# EasyEDA Pro project ProDoc_P1_2024-06-28.epro

# Schematic Schematic1
Drawed: Triority
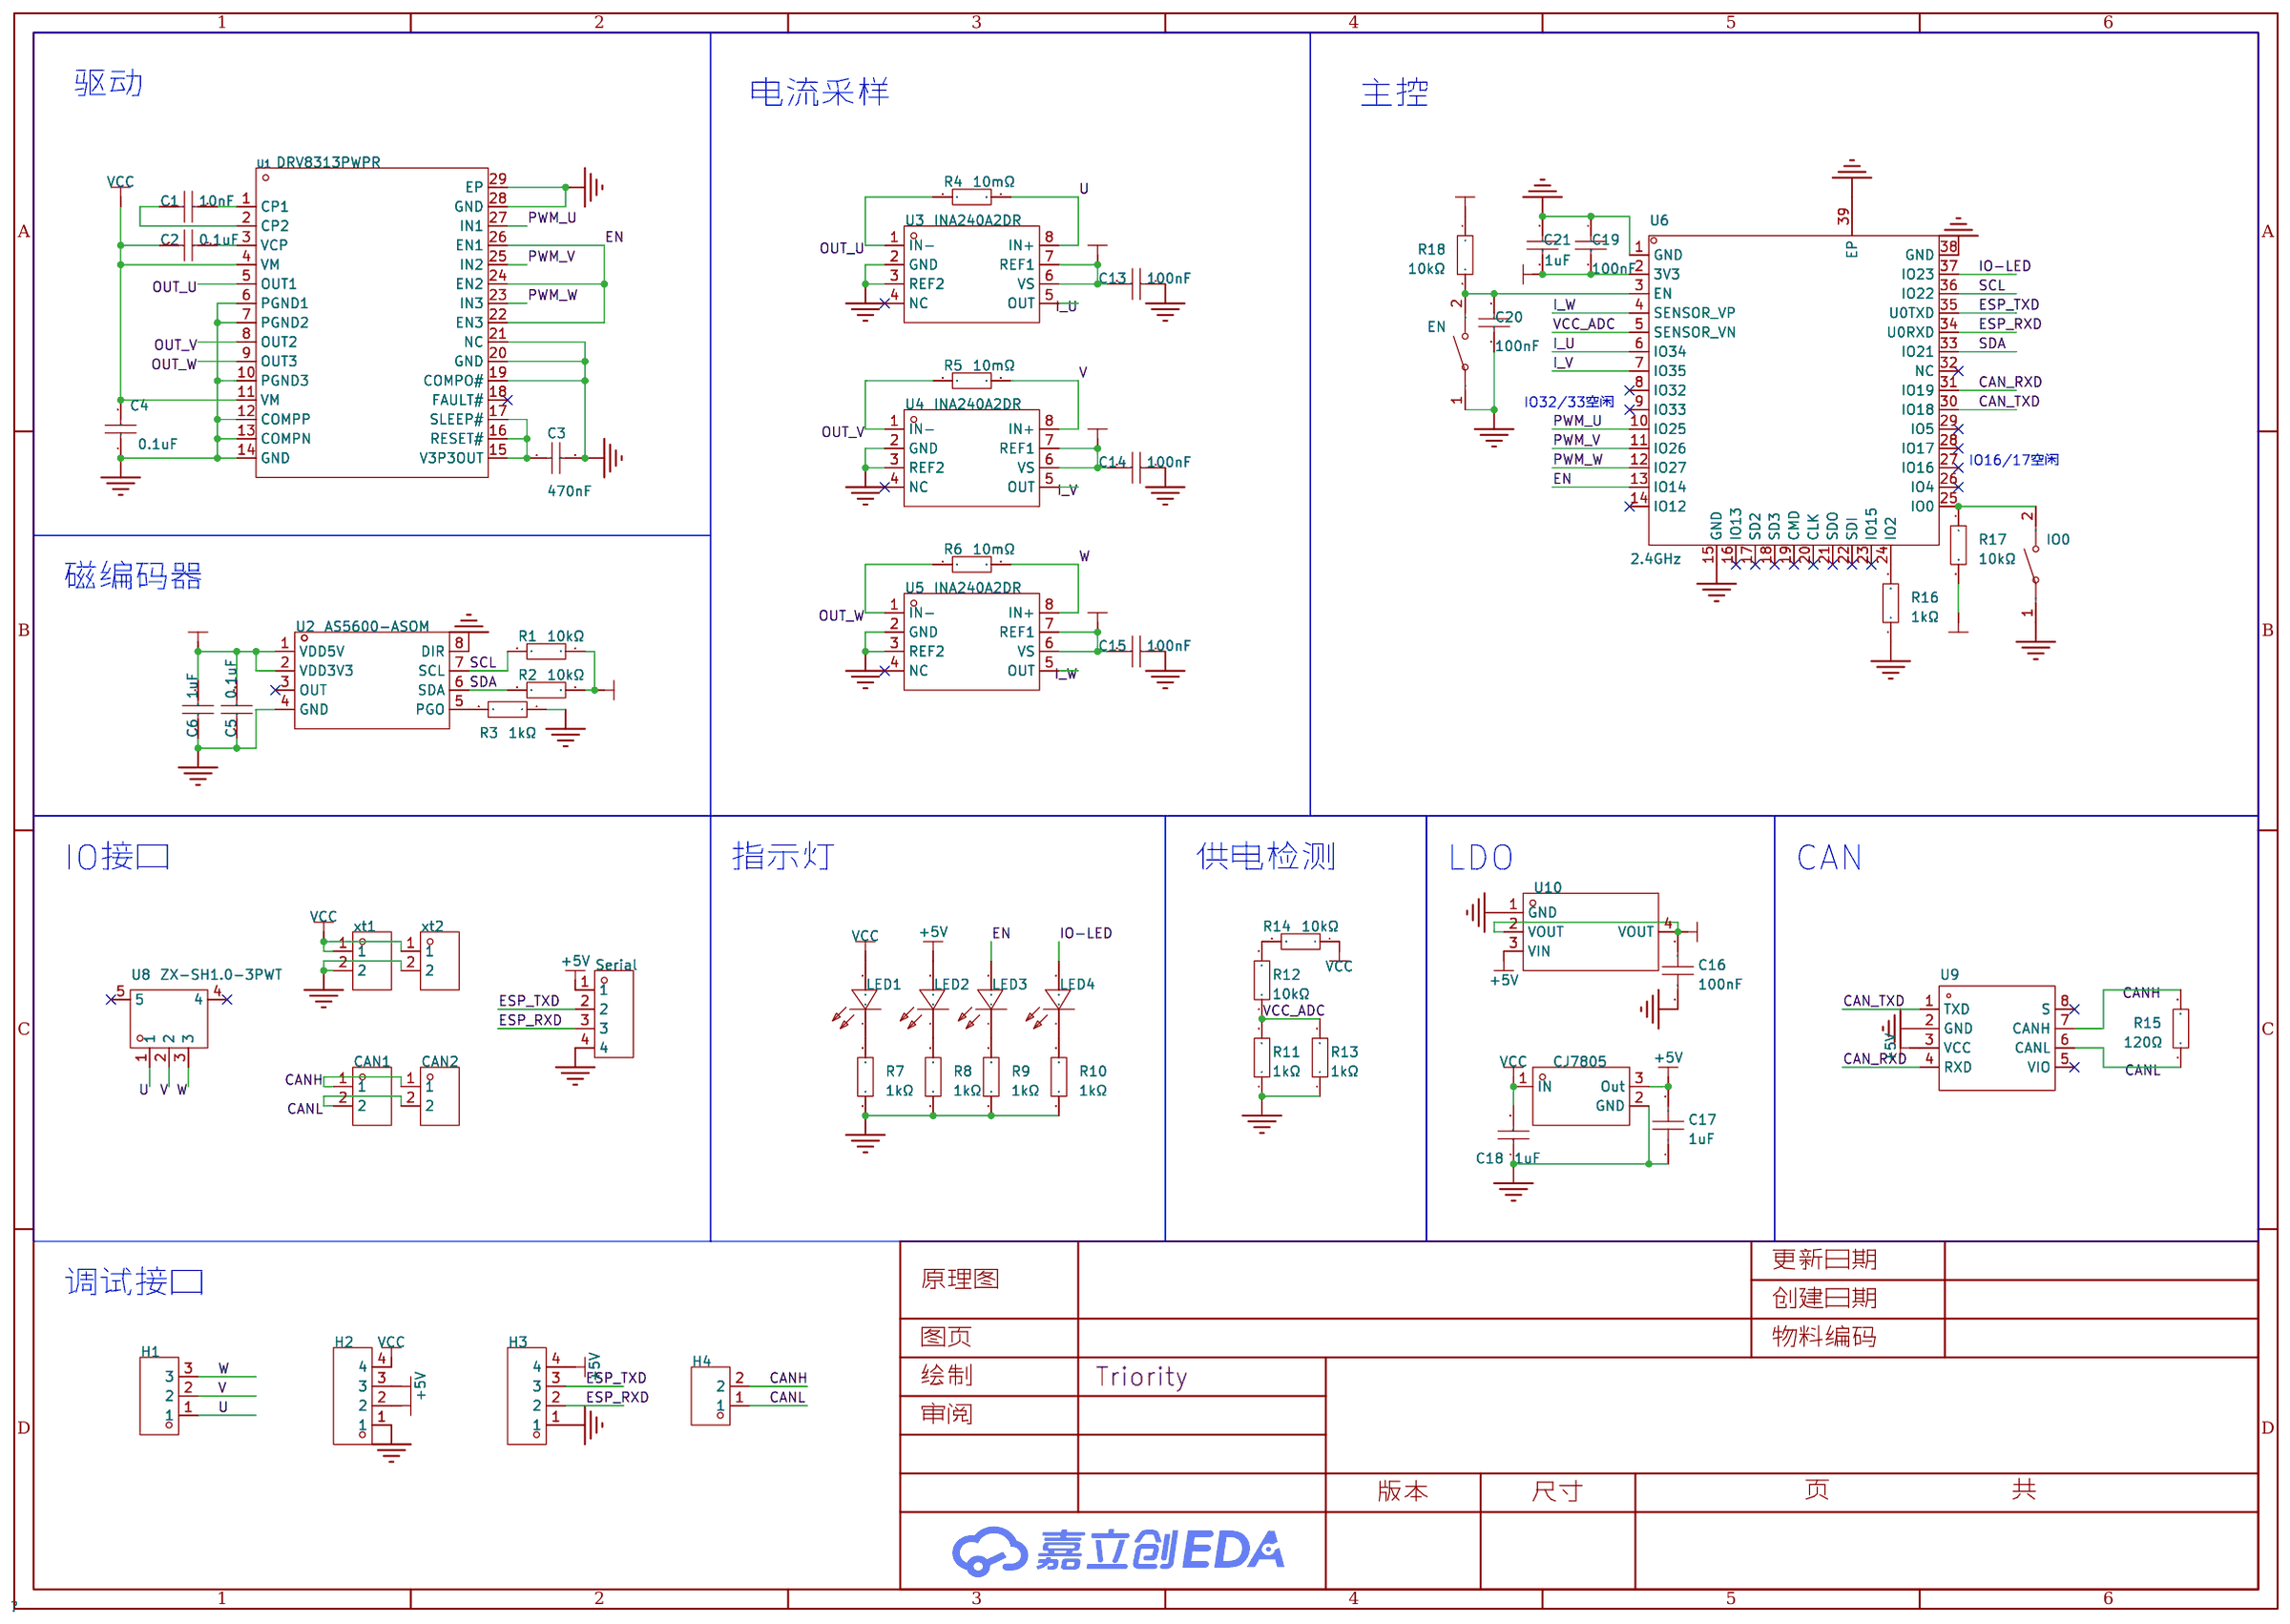
[diagram p0: schematic sheet]

## Parts
C1  10nF  [C0603]
C2  0.1uF  [C0603]
C3  470nF  [C0603]
C4  0.1uF  [C0603]
C5  0.1uF  [C0603]
C6  1uF  [C0603]
C13  100nF  [C0603]
C14  100nF  [C0603]
C15  100nF  [C0603]
C16  100nF  [C0603]
C17  1uF  [C0603]
C18  1uF  [C0603]
C19  100nF  [C0603]
C20  100nF  [C0603]
C21  1uF  [C0603]
CAN1  XH-2AW  [CONN-TH_XH-2AW_C2908611]
CAN2  XH-2AW  [CONN-TH_XH-2AW_C2908611]
CJ7805  CJ7805 3%  [TO-252-2_L6.6-W6.1-P4.58-LS10.1-BR-CW]
EN  K2-1107ST-A4DW-06  [KEY-SMD_L6.2-W3.6-LS8.0]
H1  PZ254V-11-03P  [HDR-TH_3P-P2.54-V-M]
H2  PZ254V-11-04P  [HDR-TH_4P-P2.54-V-M]
H3  PZ254V-11-04P  [HDR-TH_4P-P2.54-V-M]
H4  PZ254V-11-02P  [HDR-TH_2P-P2.54-V-M]
IO0  K2-1107ST-A4DW-06  [KEY-SMD_L6.2-W3.6-LS8.0]
LED1  KT-0603R  [LED0603-RD]
LED2  KT-0603R  [LED0603-RD]
LED3  KT-0603R  [LED0603-RD]
LED4  KT-0603R  [LED0603-RD]
R1  10kΩ  [R0603]
R2  10kΩ  [R0603]
R3  1kΩ  [R0603]
R4  10mΩ  [R1206]
R5  10mΩ  [R1206]
R6  10mΩ  [R1206]
R7  1kΩ  [R0603]
R8  1kΩ  [R0603]
R9  1kΩ  [R0603]
R10  1kΩ  [R0603]
R11  1kΩ  [R0603]
R12  10kΩ  [R0603]
R13  1kΩ  [R0603]
R14  10kΩ  [R0603]
R15  120Ω  [R0603]
R16  1kΩ  [R0603]
R17  10kΩ  [R0603]
R18  10kΩ  [R0603]
Serial  XH-4AW  [CONN-TH_XH-4AW]
U1  DRV8313PWPR  [HTSSOP-28_L9.8-W4.5-P0.65-LS6.6-BL-EP]
U2  AS5600-ASOM  [SOIC-8_L5.0-W4.0-P1.27-LS6.0-BL]
U3  INA240A2DR  [SOIC-8_L4.9-W3.9-P1.27-LS6.0-BL]
U4  INA240A2DR  [SOIC-8_L4.9-W3.9-P1.27-LS6.0-BL]
U5  INA240A2DR  [SOIC-8_L4.9-W3.9-P1.27-LS6.0-BL]
U6  2.4GHz  [WIRELM-SMD_ESP32-S]
U8  ZX-SH1.0-3PWT  [CONN-SMD_3P-P1.00_MEGASTAR_ZX-SH1.0-3PWT]
U9  TJA1051T/3/1J  [SOIC-8_L4.9-W3.9-P1.27-LS6.0-BL]
U10  AMS1117-3.3  [SOT-223-3_L6.5-W3.4-P2.30-LS7.0-BR]
xt1  XT30U-M  [CONN-TH_XT30U-M]
xt2  XT30U-M  [CONN-TH_XT30U-M]

## Library data of the parts
C1 = CC0603KRX7R9BB103: 容值:10nF;精度:±10%;额定电压:50V;材质(温度系数):X7R;; LCSC Part Name: 10nF ±10% 50V; Supplier Part: C100042; Manufacturer: YAGEO(国巨); Supplier Footprint: 0603; JLCPCB Part Class: 扩展库; Datasheet: https://atta.szlcsc.com/upload/public/pdf/source/20181008/C309510_22F155564471FAF6A489F7D68F34234E.pdf; Supplier: LCSC; Tolerance: ±10%; Voltage Rated: 50V; Temperature Coefficient: X7R
C2 C4 C5 C13-C15 C19 C20 = 0603B104K500NT: 容值:100nF;精度:±10%;额定电压:50V;材质(温度系数):X7R;; LCSC Part Name: 100nF ±10% 50V; Supplier Part: C30926; Manufacturer: FH(风华); Supplier Footprint: 0603; JLCPCB Part Class: Extended Part; Datasheet: https://atta.szlcsc.com/upload/public/pdf/source/20200305/C486355_26A10D38EF8C2A5C37091D0039909270.pdf; Supplier: LCSC; Tolerance: ±10%; Voltage Rated: 50V; Temperature Coefficient: X7R
C3 = CL10B474KA8NNNC: 容值:470nF;精度:±10%;额定电压:25V;材质(温度系数):X7R;; LCSC Part Name: 470nF ±10% 25V; Supplier Part: C1623; Manufacturer: SAMSUNG(三星); Supplier Footprint: 0603; JLCPCB Part Class: Basic Part; Datasheet: https://atta.szlcsc.com/upload/public/pdf/source/20160218/1457707763339.pdf; Supplier: LCSC; Tolerance: ±10%; Voltage Rated: 25V; Temperature Coefficient: X7R
C6 C18 C21 = CL10A105KB8NNNC: 容值:1uF;精度:±10%;额定电压:50V;材质(温度系数):X5R;; LCSC Part Name: 1uF ±10% 50V; Supplier Part: C15849; Manufacturer: SAMSUNG(三星); Supplier Footprint: 0603; JLCPCB Part Class: Basic Part; Datasheet: https://atta.szlcsc.com/upload/public/pdf/source/20160218/1457707763339.pdf; Supplier: LCSC; Tolerance: ±10%; Voltage Rated: 50V; Temperature Coefficient: X5R
C16 C17 = CC0603KRX7R9BB104: LCSC Part Name: 100nF ±10% 50V; Supplier Part: C14663; Manufacturer: YAGEO(国巨); Supplier Footprint: 0603; JLCPCB Part Class: 基础库; Datasheet: https://atta.szlcsc.com/upload/public/pdf/source/20180910/C282072_33301C7F631E79921B82A8DAC6BCC5B3.pdf; Supplier: LCSC; Tolerance: ±10%; Voltage Rated: 50V; Temperature Coefficient: X7R
CAN1 CAN2 = XH-2AW_C2908611: LCSC Part Name: 1x2P 间距:2.54mm 弯插 系列:XH; Supplier Part: C2908611; Manufacturer: HCTL(华灿天禄); Supplier Footprint: 弯插,P=2.54mm; JLCPCB Part Class: 扩展库; Datasheet: https://atta.szlcsc.com/upload/public/pdf/source/20230711/B565BAF3B11666EF6B81B3605408F2BD.pdf; Supplier: LCSC; Pins Structure: 1x2P; Pitch: 2.54mm; Mounting Style: 弯插; Reference Series: XH; Number of Pins: 2P; Number of Rows: 1; Number of PINs Per Row: 2; Current Rating (Max): 3A; Contact Material: 黄铜; Contact Plating: 锡; Operating Temperature Range: -25℃~+85℃
CJ7805 = CJ7805 3%: LCSC Part Name: 输入35V 输出5V 1.5A; Supplier Part: C21706; Manufacturer: CJ(江苏长电/长晶); Supplier Footprint: TO-252-2(DPAK); JLCPCB Part Class: 扩展库; Datasheet: https://atta.szlcsc.com/upload/public/pdf/source/20171228/C164904_15144413121361213907.pdf; Supplier: LCSC; Output Type: 固定; Maximum Input Voltage: 35V; Output Voltage: 5V; MAX Output Current: 1.5A; Dropout Voltage: 2V@(1A); Output Polarity: 正极; Number of Outputs: 1
EN IO0 = K2-1107ST-A4DW-06: LCSC Part Name: 轻触开关 3.6*6.1*2.5; Supplier Part: C118141; Manufacturer: 韩国韩荣; Supplier Footprint: SMD; JLCPCB Part Class: 扩展库; Datasheet: https://atta.szlcsc.com/upload/public/pdf/source/20210810/381712CEF248770C072B585C3485C888.pdf; Supplier: LCSC; Circuit: 单刀单掷; Actuator Style: 矩形按钮; Operating Force: 250gf; Mounting Style: 立贴; Switch Length: 6.1mm; Switch Width: 3.6mm; Switch Height: 2.5mm; Contact Current: 50mA; Voltage Rating (DC): 12V; Insulation Resistance: 100MΩ; Mechanical Life: 10万次; Operating Temperature: -25℃~+85℃
H1 = PZ254V-11-03P: LCSC Part Name: 间距:2.54mm 1x3P 直插 方针; Supplier Part: C2937625; Manufacturer: XFCN(兴飞); Supplier Footprint: 插件,P=2.54mm; JLCPCB Part Class: 扩展库; Datasheet: https://atta.szlcsc.com/upload/public/pdf/source/20200309/C492402_8335C3D49C4E4C618838D59BB1D024C1.pdf; Supplier: LCSC; Pin Structure: 1x3P; Pitch: 2.54mm; Circluar Pins/Square Pins: 方针; Mounting Type: 直插; Number of Rows: 单排; Number of Pins: 3P; Current Rating (Max): 3A; Voltage Rating (Max): 250V; Length of Mating Pin: 6mm; Insulation Height: 2.5mm; Length of End Connection Pin: 3mm; Operating Temperature Range: -40℃~+105℃; Color: 黑色
H2 H3 = PZ254V-11-04P: LCSC Part Name: 间距:2.54mm 1x4P 直插 方针; Supplier Part: C2691448; Manufacturer: XFCN(兴飞); Supplier Footprint: 插件,P=2.54mm; JLCPCB Part Class: 扩展库; Datasheet: https://atta.szlcsc.com/upload/public/pdf/source/20200309/C492403_F9F19131791D08044AD4F84F8E751A34.pdf; Supplier: LCSC; Pin Structure: 1x4P; Pitch: 2.54mm; Circluar Pins/Square Pins: 方针; Mounting Type: 直插; Number of Rows: 单排; Number of Pins: 4P; Current Rating (Max): 3A; Voltage Rating (Max): 250V; Length of Mating Pin: 6mm; Insulation Height: 2.5mm; Length of End Connection Pin: 3mm; Operating Temperature Range: -40℃~+105℃; Color: 黑色
H4 = PZ254V-11-02P: LCSC Part Name: 间距:2.54mm 1x2P 直插 方针; Supplier Part: C492401; Manufacturer: XFCN(兴飞); Supplier Footprint: 插件,P=2.54mm; JLCPCB Part Class: 扩展库; Datasheet: https://atta.szlcsc.com/upload/public/pdf/source/20200309/C492401_A812433581A9B211A7FFA413ADDFF0E5.pdf; Supplier: LCSC; Pin Structure: 1x2P; Pitch: 2.54mm; Circluar Pins/Square Pins: 方针; Mounting Type: 直插; Number of Rows: 单排; Number of Pins: 2P; Length of Mating Pin: 6mm; Insulation Height: 2.5mm; Length of End Connection Pin: 3mm; Contact Material: 黄铜; Operating Temperature Range: -40℃~+105℃; Color: 黑色
LED1-LED4 = KT-0603R: LCSC Part Name: 0603 红灯 高亮; Supplier Part: C2286; Manufacturer: KENTO; Supplier Footprint: 0603; JLCPCB Part Class: 基础库; Datasheet: https://atta.szlcsc.com/upload/public/pdf/source/20160616/1466072038404.pdf; Supplier: LCSC; Emitted Color: 红色; Operating Temperature: -40℃~+85℃
R1 R2 R12 R14 R17 R18 = RC0603FR-0710KL: 电阻类型:厚膜电阻;阻值:10kΩ;精度:±1%;功率:100mW;最大工作电压:75V;温度系数:±100ppm/℃;; LCSC Part Name: 厚膜电阻 10kΩ ±1% 100mW; Supplier Part: C98220; Manufacturer: YAGEO(国巨); Supplier Footprint: 0603; JLCPCB Part Class: 扩展库; Datasheet: https://atta.szlcsc.com/upload/public/pdf/source/20180927/C295883_E8D83085EA81BD7DE0B2B681138C15EE.pdf; Supplier: LCSC; Type: 厚膜电阻; Tolerance: ±1%; Power(Watts): 100mW; Overload Voltage (Max): 75V; Temperature Coefficient: ±100ppm/℃; Operating Temperature Range: -55℃~+155℃
R3 = RC0603FR-071KL: 电阻类型:厚膜电阻;阻值:1kΩ;精度:±1%;功率:100mW;最大工作电压:75V;温度系数:±100ppm/℃;; LCSC Part Name: 厚膜电阻 1kΩ ±1% 100mW; Supplier Part: C22548; Manufacturer: YAGEO(国巨); Supplier Footprint: 0603; JLCPCB Part Class: 扩展库; Datasheet: https://atta.szlcsc.com/upload/public/pdf/source/20180316/70C0E2BDAE7FCC62C531A5A58D202EE1.pdf; Supplier: LCSC; Type: 厚膜电阻; Tolerance: ±1%; Power(Watts): 100mW; Overload Voltage (Max): 75V; Temperature Coefficient: ±100ppm/℃; Operating Temperature Range: -55℃~+155℃
R4-R6 = RLM12FTCMR010: 阻值:10mΩ;精度:±1%;功率:1W;温度系数:±100ppm/℃;; LCSC Part Name: 10mΩ ±1% 1W; Supplier Part: C188070; Manufacturer: 大毅科技; Supplier Footprint: 1206; JLCPCB Part Class: 扩展库; Datasheet: https://atta.szlcsc.com/upload/public/pdf/source/20181023/C316226_D363EC3D88B44FBEE1B74F4A1DF43EB9.pdf; Supplier: LCSC; Tolerance: ±1%; Power(Watts): 1W; Temperature Coefficient: ±100ppm/℃
R7-R11 R13 R16 = 0603WAF1001T5E: LCSC Part Name: 1kΩ ±1% 100mW 厚膜电阻; Supplier Part: C21190; Manufacturer: UNI-ROYAL(厚声); Supplier Footprint: 0603; JLCPCB Part Class: 基础库; Datasheet: https://atta.szlcsc.com/upload/public/pdf/source/20200306/C422600_1E6D84923E4A46A82E41ADD87F860B5C.pdf; Supplier: LCSC; Type: 厚膜电阻; Tolerance: ±1%; Power(Watts): 100mW; Overload Voltage (Max): 75V; Temperature Coefficient: ±100ppm/℃; Operating Temperature Range: -55℃~+155℃
R15 = 0603WAF1200T5E: LCSC Part Name: 120Ω ±1% 100mW 厚膜电阻; Supplier Part: C22787; Manufacturer: UNI-ROYAL(厚声); Supplier Footprint: 0603; JLCPCB Part Class: 基础库; Datasheet: https://atta.szlcsc.com/upload/public/pdf/source/20200306/C422600_1E6D84923E4A46A82E41ADD87F860B5C.pdf; Supplier: LCSC; Type: 厚膜电阻; Tolerance: ±1%; Power(Watts): 100mW; Overload Voltage (Max): 75V; Temperature Coefficient: ±100ppm/℃; Operating Temperature Range: -55℃~+155℃
Serial = XH-4AW: LCSC Part Name: 1x4P 间距:2.54mm 弯插 系列:XH; Supplier Part: C2908613; Manufacturer: HCTL(华灿天禄); Supplier Footprint: 弯插,P=2.54mm; JLCPCB Part Class: 扩展库; Datasheet: https://atta.szlcsc.com/upload/public/pdf/source/20230711/B565BAF3B11666EF6B81B3605408F2BD.pdf; Supplier: LCSC; Pins Structure: 1x4P; Pitch: 2.54mm; Mounting Style: 弯插; Reference Series: XH; Number of Pins: 4P; Number of Rows: 1; Number of PINs Per Row: 4; Current Rating (Max): 3A; Contact Material: 黄铜; Contact Plating: 锡; Operating Temperature Range: -25℃~+85℃
U1 = DRV8313PWPR: 驱动电机类型:无刷直流BLDC;电源电压:8V~60V;输出电流:-;接口:并行;; LCSC Part Name: 无刷直流BLDC电机驱动芯片 60V; Supplier Part: C92482; Manufacturer: TI(德州仪器); Supplier Footprint: HTSSOP-28-EP-4.5mm; JLCPCB Part Class: 扩展库; Datasheet: https://www.ti.com/cn/lit/gpn/drv8313; Supplier: LCSC; Drive motor type: 无刷直流BLDC; Supply Voltage: 8V~60V; Interface: 并行; Operating Temperature: -40℃~+150℃@(Tj)
U2 = AS5600-ASOM: 旋转角度范围:0°~360°;; Supplier Part: C79815; Manufacturer: ams(艾迈斯半导体); Supplier Footprint: SOIC-8; JLCPCB Part Class: 扩展库; Datasheet: https://atta.szlcsc.com/upload/public/pdf/source/20161027/1477535527192.pdf; Supplier: LCSC; Supply Voltage: 5V；3.3V; Rotation Angle: 0°~360°
U3-U5 = INA240A2DR: 放大器数:单路;; Supplier Part: C2060768; Manufacturer: TI(德州仪器); Supplier Footprint: SOIC-8; JLCPCB Part Class: 扩展库; Datasheet: https://www.ti.com/cn/lit/gpn/ina240; Supplier: LCSC; Number of Channels: 单路; Supply Current: 1.8mA; Operating Temperature: -40℃~+125℃
U6 = ESP32-S: Supplier Part: C277944; Manufacturer: Ai-Thinker(安信可); Supplier Footprint: SMD; JLCPCB Part Class: 扩展库; Datasheet: https://atta.szlcsc.com/upload/public/pdf/source/20211217/F4BEA33E732D6002D10DAED85BBCB52B.pdf; Supplier: LCSC; Core Processor: ESP32芯片; Support Interface: I2C；UART；DAC；SPI；PWM；ADC; Antenna Type: IPEX接口; Output Power: 17dBm; Operating Voltage: 3.3V; Sensitivity: -90dBm; Operating Temperature: -40℃~+85℃
U8 = ZX-SH1.0-3PWT: 插针结构:1x3P;间距:1mm;安装方式:卧贴;参考系列:SH;总PIN数:3P;排数:1;每排PIN数:3;行距:-;额定电流:1A;触头材质:黄铜;触头镀层:锡;工作温度范围:-25℃~+85℃;; Supplier Part: C7430445; Manufacturer: Megastar(兆星); Supplier Footprint: SMD,P=1mm,卧贴; JLCPCB Part Class: Extended Part; Datasheet: https://atta.szlcsc.com/upload/public/pdf/source/20230619/CFE52D4011A035D5D140AE40938A4C7D.pdf; Supplier: LCSC; Pins Structure: 1x3P; Pitch: 1mm; Mounting Style: 卧贴; Reference Series: SH; Number of Pins: 3P; Number of Rows: 1; Number of PINs Per Row: 3; Current Rating (Max): 1A; Contact Material: 黄铜; Contact Plating: 锡; Operating Temperature Range: -25℃~+85℃
U9 = TJA1051T/3/1J: Supplier Part: C38695; Manufacturer: NXP(恩智浦); Supplier Footprint: SOIC-8-150mil; JLCPCB Part Class: 扩展库; Datasheet: https://atta.szlcsc.com/upload/public/pdf/source/20210128/C2671135_A82E49CDEFC20634F2534E8F261E286A.pdf; Supplier: LCSC; Type: 收发器; Data Rate: 5Mbps; Supply Voltage: 4.5V~5.5V; Supply Current: 5mA; Operating Temperature: -40℃~+150℃
U10 = AMS1117-3.3_C6186: LCSC Part Name: 输出3.3V 1A; Supplier Part: C6186; Manufacturer: AMS; Supplier Footprint: SOT-223; JLCPCB Part Class: 基础库; Datasheet: https://atta.szlcsc.com/upload/public/pdf/source/20180727/C6186_7A095716F0823C02F1997A905E26C086.pdf; Supplier: LCSC; Output Type: 固定; Output Voltage: 3.3V; MAX Output Current: 1A; Power Supply Rejection Ratio (PSRR): 72dB@(120Hz); Dropout Voltage: 1.3V@(800mA); Output Polarity: 正极; Number of Outputs: 1
xt1 xt2 = XT30U-M: LCSC Part Name: AMASS(艾迈斯)轻量版锂电池插头公头 XT30U-M; Supplier Part: C99101; Manufacturer: AMASS(艾迈斯); JLCPCB Part Class: 扩展库; Datasheet: https://atta.szlcsc.com/upload/public/pdf/source/20170606/1496716542582.pdf; Supplier: LCSC; Brand: 艾迈斯; Type: 插头; Colour: 黄色; InterfaceType: 公头

## Nets
3V3: C5.2 C6.2 C13.2 C14.2 C15.2 C16.2 C19.2 C21.1 H2.2 R1.1 R2.1 R17.2 R18.1 U2.1(VDD5V) U2.2(VDD3V3) U3.6(VS) U3.7(REF1) U4.6(VS) U4.7(REF1) U5.6(VS) U5.7(REF1) U6.2(3V3) U10.2(VOUT) U10.4(VOUT)
+5V: C17.2 CJ7805.3(Out) H2.3 H3.4 LED2.2(A) Serial.1 U9.3(VCC) U10.3(VIN)
GND: C3.1 C4.1 C5.1 C6.1 C13.1 C14.1 C15.1 C16.1 C17.1 C18.1 C19.1 C20.2 C21.2 CJ7805.2(GND) EN.1 H2.1 H3.1 IO0.1 R3.1 R7.1 R8.1 R9.1 R10.1 R11.1 R13.1 R16.1 Serial.4 U1.6(PGND1) U1.7(PGND2) U1.10(PGND3) U1.12(COMPP) U1.13(COMPN) U1.14(GND) U1.19(COMPO#) U1.20(GND) U1.21(NC) U1.28(GND) U1.29(EP) U2.4(GND) U2.8(DIR) U3.2(GND) U3.3(REF2) U4.2(GND) U4.3(REF2) U5.2(GND) U5.3(REF2) U6.1(GND) U6.15(GND) U6.38(GND) U6.39(EP) U9.2(GND) U10.1(GND) xt1.2 xt2.2
VCC: C2.1 C4.2 C18.2 CJ7805.1(IN) H2.4 LED1.2(A) R14.1 U1.4(VM) U1.11(VM) xt1.1 xt2.1
VCC_ADC: R11.2 R12.1 R13.2 U6.5(SENSOR_VN)
CAN_RXD: U6.31(IO19) U9.4(RXD)
CAN_TXD: U6.30(IO18) U9.1(TXD)
CANH: CAN1.1 CAN2.1 H4.2 R15.2 U9.7(CANH)
CANL: CAN1.2 CAN2.2 H4.1 R15.1 U9.6(CANL)
EN: LED3.2(A) U1.22(EN3) U1.24(EN2) U1.26(EN1) U6.13(IO14)
ESP_RXD: H3.2 Serial.3 U6.34(U0RXD)
ESP_TXD: H3.3 Serial.2 U6.35(U0TXD)
I_U: U3.5(OUT) U6.6(IO34)
I_V: U4.5(OUT) U6.7(IO35)
I_W: U5.5(OUT) U6.4(SENSOR_VP)
IO-LED: LED4.2(A) U6.37(IO23)
OUT_U: R4.1 U1.5(OUT1) U3.1(IN-)
OUT_V: R5.1 U1.8(OUT2) U4.1(IN-)
OUT_W: R6.1 U1.9(OUT3) U5.1(IN-)
PWM_U: U1.27(IN1) U6.10(IO25)
PWM_V: U1.25(IN2) U6.11(IO26)
PWM_W: U1.23(IN3) U6.12(IO27)
SCL: R1.2 U2.7(SCL) U6.36(IO22)
SDA: R2.2 U2.6(SDA) U6.33(IO21)
U: H1.1 R4.2 U3.8(IN+) U8.1
V: H1.2 R5.2 U4.8(IN+) U8.2
W: H1.3 R6.2 U5.8(IN+) U8.3
Net-(C1-1): C1.1 U1.2(CP2)
Net-(C1-2): C1.2 U1.1(CP1)
Net-(C2-2): C2.2 U1.3(VCP)
Net-(C3-2): C3.2 U1.15(V3P3OUT) U1.16(RESET#) U1.17(SLEEP#)
Net-(C20-1): C20.1 EN.2 R18.2 U6.3(EN)
Net-(IO0-2): IO0.2 R17.1 U6.25(IO0)
Net-(LED1-1): LED1.1(K) R7.2
Net-(LED2-1): LED2.1(K) R8.2
Net-(LED3-1): LED3.1(K) R9.2
Net-(LED4-1): LED4.1(K) R10.2
Net-(R3-2): R3.2 U2.5(PGO)
Net-(R12-2): R12.2 R14.2
Net-(R16-2): R16.2 U6.24(IO2)

Not connected (* = marked no-connect by the designer): U1 18(FAULT#)*; U2 3(OUT)*; U3 4(NC)*; U4 4(NC)*; U5 4(NC)*; U6 8(IO32)* 9(IO33)* 14(IO12)* 16(IO13)* 17(SD2)* 18(SD3)* 19(CMD)* 20(CLK)* 21(SDO)* 22(SDI)* 23(IO15)* 26(IO4)* 27(IO16)* 28(IO17)* 29(IO5)* 32(NC)*; U8 4* 5*; U9 5(VIO)* 8(S)*

## Notes on the sheet
- 驱动
- 电流采样
- 主控
- IO32/33空闲
- IO16/17空闲
- 磁编码器
- IO接口
- 指示灯
- 供电检测
- LDO
- CAN
- 调试接口
